# EAGLE schematic extruderControllerv1 (EAGLE 9.3.1)
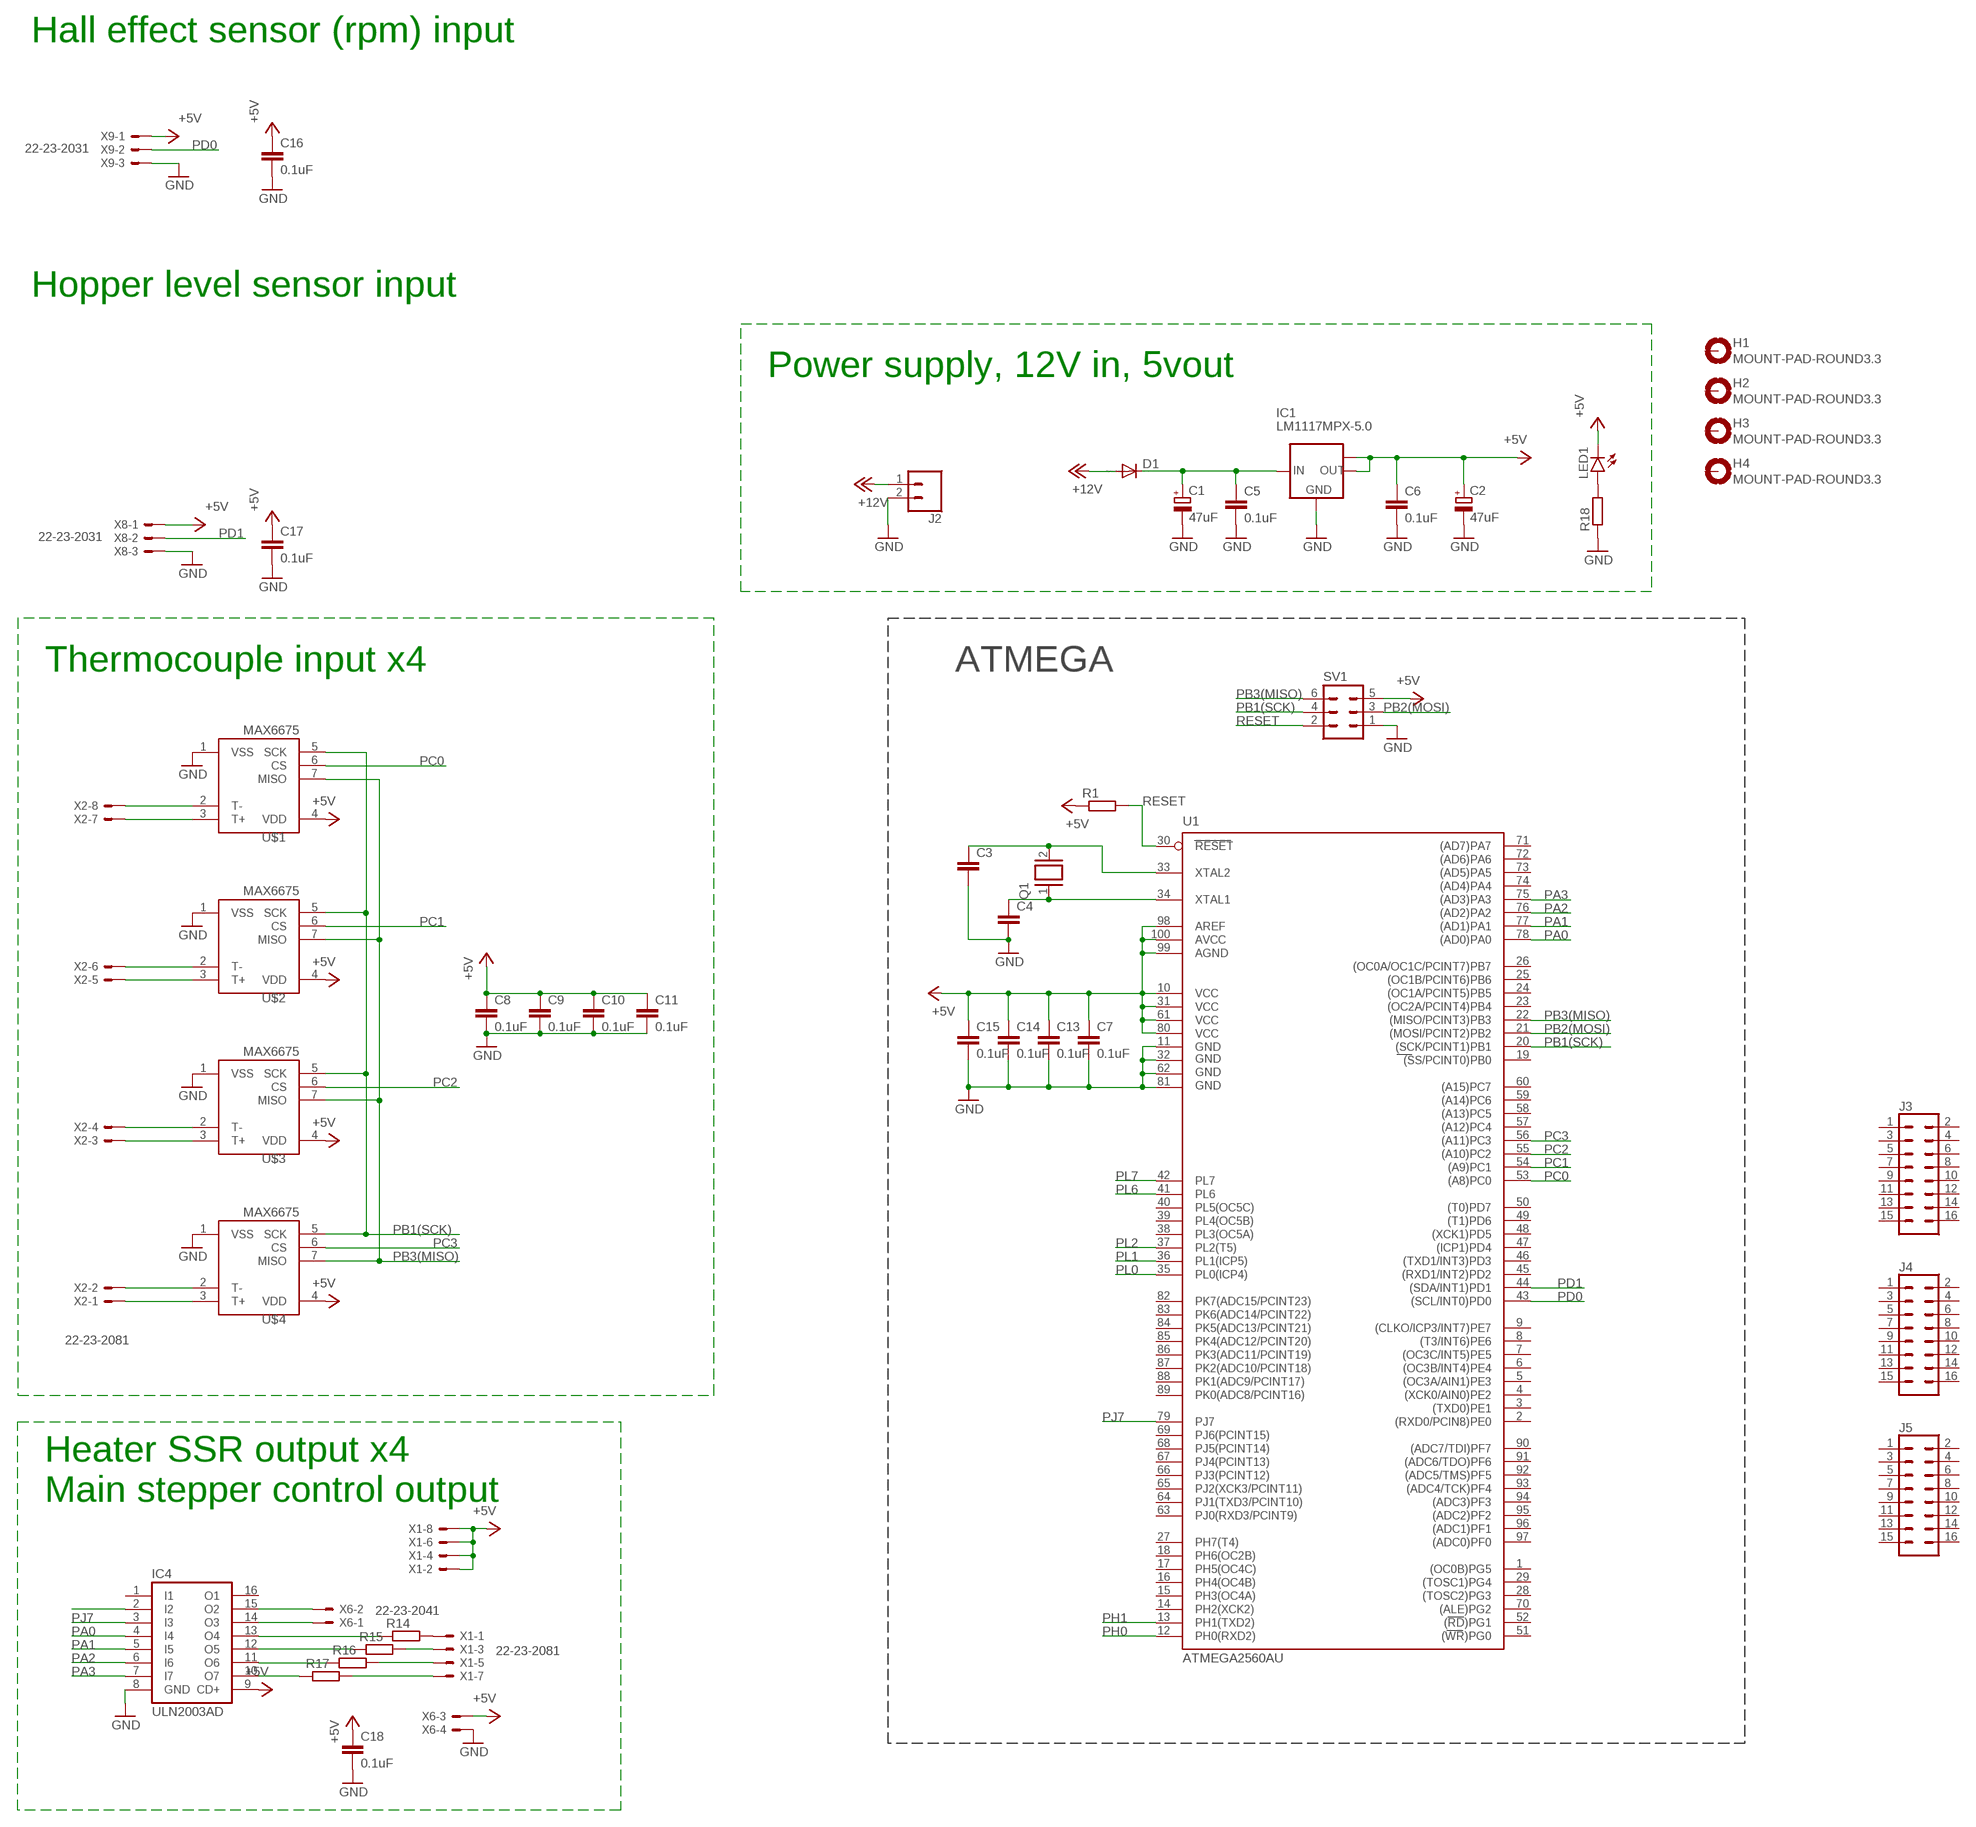
[diagram p0: schematic, sheet 1, part 1 of 3]
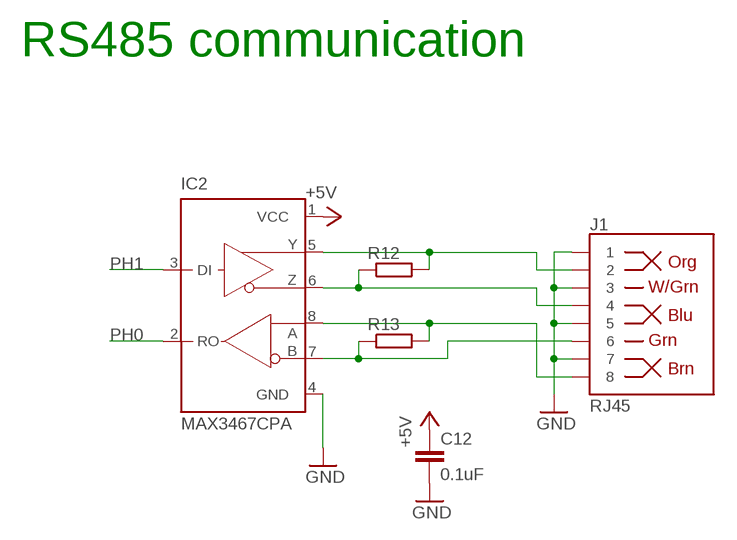
[diagram p1: schematic, sheet 1, part 2 of 3]
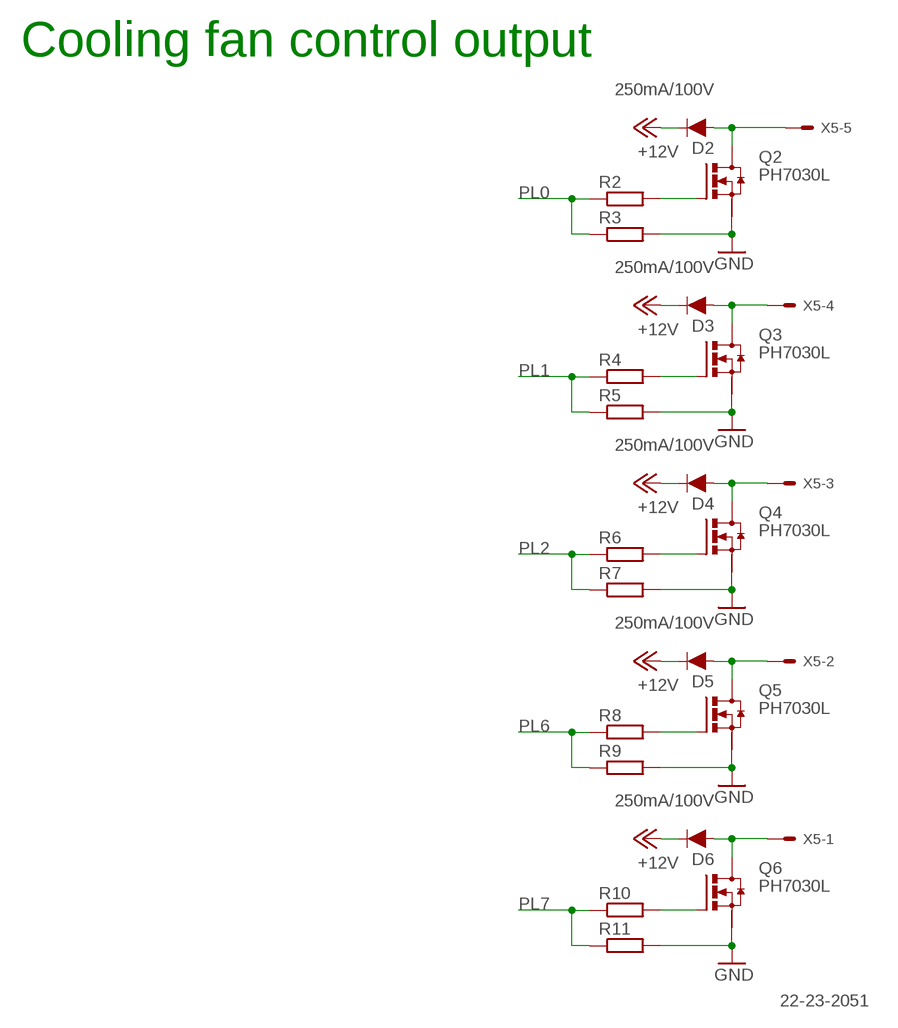
[diagram p2: schematic, sheet 1, part 3 of 3]

## Parts
C1  47uF  CPOL-EUD  [PANASONIC_D]
C2  47uF  CPOL-EUD  [PANASONIC_D]
C3  C-EUC0603  [C0603]
C4  C-EUC0603  [C0603]
C5  0.1uF  C-EUC0603  [C0603]
C6  0.1uF  C-EUC0603  [C0603]
C7  0.1uF  C-EUC0603  [C0603]
C8  0.1uF  C-EUC0603  [C0603]
C9  0.1uF  C-EUC0603  [C0603]
C10  0.1uF  C-EUC0603  [C0603]
C11  0.1uF  C-EUC0603  [C0603]
C12  0.1uF  C-EUC0603  [C0603]
C13  0.1uF  C-EUC0603  [C0603]
C14  0.1uF  C-EUC0603  [C0603]
C15  0.1uF  C-EUC0603  [C0603]
C16  0.1uF  C-EUC0603  [C0603]
C17  0.1uF  C-EUC0603  [C0603]
C18  0.1uF  C-EUC0603  [C0603]
D1  DIODE-SMB  [SMB]
D2  250mA/100V  DIODE-BAS16J  [SOD-323]
D3  250mA/100V  DIODE-BAS16J  [SOD-323]
D4  250mA/100V  DIODE-BAS16J  [SOD-323]
D5  250mA/100V  DIODE-BAS16J  [SOD-323]
D6  250mA/100V  DIODE-BAS16J  [SOD-323]
H1  MOUNT-PAD-ROUND3.3  [3,3-PAD]
H2  MOUNT-PAD-ROUND3.3  [3,3-PAD]
H3  MOUNT-PAD-ROUND3.3  [3,3-PAD]
H4  MOUNT-PAD-ROUND3.3  [3,3-PAD]
IC1  LM1117MPX-5.0  [SOT223]
IC2  MAX3467CPA  [SO08]
IC4  ULN2003AD  [SO16]
J1  RJ45  RJ45-8  [RJ45-8]
J2  CONN_023.5MM  [SCREWTERMINAL-3.5MM-2]
J3  CONN_08X2  [2X8]
J4  CONN_08X2  [2X8]
J5  CONN_08X2  [2X8]
LED1  LEDSML1206  [SML1206]
Q1  XTAL/S  [QS]
Q2  PH7030L  [SOT669]
Q3  PH7030L  [SOT669]
Q4  PH7030L  [SOT669]
Q5  PH7030L  [SOT669]
Q6  PH7030L  [SOT669]
R1  R-EU_R0805  [R0805]
R2  R-EU_R0805  [R0805]
R3  R-EU_R0805  [R0805]
R4  R-EU_R0805  [R0805]
R5  R-EU_R0805  [R0805]
R6  R-EU_R0805  [R0805]
R7  R-EU_R0805  [R0805]
R8  R-EU_R0805  [R0805]
R9  R-EU_R0805  [R0805]
R10  R-EU_R0805  [R0805]
R11  R-EU_R0805  [R0805]
R12  R-EU_R1210  [R1210]
R13  R-EU_R1210  [R1210]
R14  R-EU_R0805  [R0805]
R15  R-EU_R0805  [R0805]
R16  R-EU_R0805  [R0805]
R17  R-EU_R0805  [R0805]
R18  R-EU_R0805  [R0805]
SV1  MA03-2  [MA03-2]
U1  ATMEGA2560AU  [TQFP100]
U$1  MAX6675  [SO08-MAX6675]
U$2  MAX6675  [SO08-MAX6675]
U$3  MAX6675  [SO08-MAX6675]
U$4  MAX6675  [SO08-MAX6675]
X1  22-23-2081  [22-23-2081]
X2  22-23-2081  [22-23-2081]
X5  22-23-2051  [22-23-2051]
X6  22-23-2041  [22-23-2041]
X8  22-23-2031  [22-23-2031]
X9  22-23-2031  [22-23-2031]

## Nets
+5V: C2.+ C6.1 C7.1 C8.1 C9.1 C10.1 C11.1 C12.1 C13.1 C14.1 C15.1 C16.1 C17.1 C18.1 IC1.2(OUT) IC1.TAB(OUT1) IC2.1(VCC) IC4.9(CD+) LED1.C R1.1 SV1.5 U1.10(VCC) U1.31(VCC1) U1.61(VCC2) U1.80(VCC3) U1.98(AREF) U1.99(AGND) U1.100(AVCC) U$1.4(VDD) U$2.4(VDD) U$3.4(VDD) U$4.4(VDD) X1.2 X1.4 X1.6 X1.8 X6.3 X8.1 X9.1
+12V: D1.A D2.C D3.C D4.C D5.C D6.C J2.1
GND: C1.- C2.- C3.2 C4.2 C5.2 C6.2 C7.2 C8.2 C9.2 C10.2 C11.2 C12.2 C13.2 C14.2 C15.2 C16.2 C17.2 C18.2 IC1.1(GND) IC2.4(GND) IC4.8(GND) J1.1 J1.3 J1.5 J1.7 J2.2 R18.1 SV1.1 U1.11(GND) U1.32(GND1) U1.62(GND2) U1.81(GND3) U$1.1(VSS) U$2.1(VSS) U$3.1(VSS) U$4.1(VSS) X6.4 X8.3 X9.3
N$2: Q2.4(G) R2.2
N$3: R14.2 X1.1
N$4: U$1.2(T-) X2.8
N$5: U$1.3(T+) X2.7
N$6: U$2.2(T-) X2.6
N$7: U$2.3(T+) X2.5
N$8: U$3.2(T-) X2.4
N$9: U$3.3(T+) X2.3
N$10: U$4.2(T-) X2.2
N$11: U$4.3(T+) X2.1
N$12: R15.2 X1.3
N$13: R16.2 X1.5
N$14: R17.2 X1.7
N$15: Q2.1(S) Q3.1(S) Q4.1(S) Q5.1(S) Q6.1(S) R3.2 R5.2 R7.2 R9.2 R11.2 ; supply symbol labelled GND
N$18: C1.+ C5.1 D1.C IC1.3(IN)
N$19: C3.1 Q1.2 U1.33(XTAL2)
N$20: C4.1 Q1.1 U1.34(XTAL1)
N$21: IC4.14(O3) X6.1
N$22: D2.A Q2.MB(D) X5.5
N$23: Q3.4(G) R4.2
N$24: IC4.15(O2) X6.2
N$25: D3.A Q3.MB(D) X5.4
N$26: Q4.4(G) R6.2
N$27: IC2.7(B) J1.6 R13.1
N$28: D4.A Q4.MB(D) X5.3
N$29: Q5.4(G) R8.2
N$30: IC4.13(O4) R14.1
N$31: D5.A Q5.MB(D) X5.2
N$32: Q6.4(G) R10.2
N$33: IC2.6(Z) J1.4 R12.1
N$34: D6.A Q6.MB(D) X5.1
N$35: IC2.5(Y) J1.2 R12.2
N$36: IC2.8(A) J1.8 R13.2
N$37: IC4.2(I2)
N$38: IC4.12(O5) R15.1
N$39: IC4.11(O6) R16.1
N$40: IC4.10(O7) R17.1
N$41: LED1.A R18.2
PA0: IC4.4(I4) U1.78((AD0)PA0)
PA1: IC4.5(I5) U1.77((AD1)PA1)
PA2: IC4.6(I6) U1.76((AD2)PA2)
PA3: IC4.7(I7) U1.75((AD3)PA3)
PB1(SCK): SV1.4 U1.20((SCK/PCINT1)PB1) U$1.5(SCK) U$2.5(SCK) U$3.5(SCK) U$4.5(SCK)
PB2(MOSI): SV1.3 U1.21((MOSI/PCINT2)PB2)
PB3(MISO): SV1.6 U1.22((MISO/PCINT3)PB3) U$1.7(MISO) U$2.7(MISO) U$3.7(MISO) U$4.7(MISO)
PC0: U1.53((A8)PC0) U$1.6(CS)
PC1: U1.54((A9)PC1) U$2.6(CS)
PC2: U1.55((A10)PC2) U$3.6(CS)
PC3: U1.56((A11)PC3) U$4.6(CS)
PD0: U1.43((SCL/INT0)PD0) X9.2
PD1: U1.44((SDA/INT1)PD1) X8.2
PH0: IC2.2(RO) U1.12(PH0(RXD2))
PH1: IC2.3(DI) U1.13(PH1(TXD2))
PJ7: IC4.3(I3) U1.79(PJ7)
PL0: R2.1 R3.1 U1.35(PL0(ICP4))
PL1: R4.1 R5.1 U1.36(PL1(ICP5))
PL2: R6.1 R7.1 U1.37(PL2(T5))
PL6: R8.1 R9.1 U1.41(PL6)
PL7: R10.1 R11.1 U1.42(PL7)
RESET: R1.2 SV1.2 U1.30(RESET)
Unconnected: H1.B3,3(MOUNT) H2.B3,3(MOUNT) H3.B3,3(MOUNT) H4.B3,3(MOUNT) IC4.1(I1) IC4.16(O1) J3.1 J3.2 J3.3 J3.4 J3.5 J3.6 J3.7 J3.8 J3.9 J3.10 J3.11 J3.12 J3.13 J3.14 J3.15 J3.16 J4.1 J4.2 J4.3 J4.4 J4.5 J4.6 J4.7 J4.8 J4.9 J4.10 J4.11 J4.12 J4.13 J4.14 J4.15 J4.16 J5.1 J5.2 J5.3 J5.4 J5.5 J5.6 J5.7 J5.8 J5.9 J5.10 J5.11 J5.12 J5.13 J5.14 J5.15 J5.16 Q2.2(S) Q2.3(S) Q3.2(S) Q3.3(S) Q4.2(S) Q4.3(S) Q5.2(S) Q5.3(S) Q6.2(S) Q6.3(S) U1.1((OC0B)PG5) U1.2((RXD0/PCIN8)PE0) U1.3((TXD0)PE1) U1.4((XCK0/AIN0)PE2) U1.5((OC3A/AIN1)PE3) U1.6((OC3B/INT4)PE4) U1.7((OC3C/INT5)PE5) U1.8((T3/INT6)PE6) U1.9((CLKO/ICP3/INT7)PE7) U1.14(PH2(XCK2)) U1.15(PH3(OC4A)) U1.16(PH4(OC4B)) U1.17(PH5(OC4C)) U1.18(PH6(OC2B)) U1.19((SS/PCINT0)PB0) U1.23((OC2A/PCINT4)PB4) U1.24((OC1A/PCINT5)PB5) U1.25((OC1B/PCINT6)PB6) U1.26((OC0A/OC1C/PCINT7)PB7) U1.27(PH7(T4)) U1.28((TOSC2)PG3) U1.29((TOSC1)PG4) U1.38(PL3(OC5A)) U1.39(PL4(OC5B)) U1.40(PL5(OC5C)) U1.45((RXD1/INT2)PD2) U1.46((TXD1/INT3)PD3) U1.47((ICP1)PD4) U1.48((XCK1)PD5) U1.49((T1)PD6) U1.50((T0)PD7) U1.51((WR)PG0) U1.52((RD)PG1) U1.57((A12)PC4) U1.58((A13)PC5) U1.59((A14)PC6) U1.60((A15)PC7) U1.63(PJ0(RXD3/PCINT9)) U1.64(PJ1(TXD3/PCINT10)) U1.65(PJ2(XCK3/PCINT11)) U1.66(PJ3(PCINT12)) U1.67(PJ4(PCINT13)) U1.68(PJ5(PCINT14)) U1.69(PJ6(PCINT15)) U1.70((ALE)PG2) U1.71((AD7)PA7) U1.72((AD6)PA6) U1.73((AD5)PA5) U1.74((AD4)PA4) U1.82(PK7(ADC15/PCINT23)) U1.83(PK6(ADC14/PCINT22)) U1.84(PK5(ADC13/PCINT21)) U1.85(PK4(ADC12/PCINT20)) U1.86(PK3(ADC11/PCINT19)) U1.87(PK2(ADC10/PCINT18)) U1.88(PK1(ADC9/PCINT17)) U1.89(PK0(ADC8/PCINT16)) U1.90((ADC7/TDI)PF7) U1.91((ADC6/TDO)PF6) U1.92((ADC5/TMS)PF5) U1.93((ADC4/TCK)PF4) U1.94((ADC3)PF3) U1.95((ADC2)PF2) U1.96((ADC1)PF1) U1.97((ADC0)PF0)

## Notes on the sheet
- Hall effect sensor (rpm) input
- Hopper level sensor input
- Power supply, 12V in, 5vout
- RS485 communication
- Thermocouple input x4 | ATMEGA
- Heater SSR output x4
- Main stepper control output
- Cooling fan control output

## Library data of the parts
C1 C2 = rcl:CPOL-EU: POLARIZED CAPACITOR, European symbol; SPICEPREFIX: C
C3-C18 = rcl:C-EU: CAPACITOR, European symbol; SPICEPREFIX: C
D1 = diode:DIODE-: DIODE
D2-D6 = SparkFun-DiscreteSemi:DIODE: Diode These are standard reverse protection diodes and small signal diodes. SparkFun Products: SparkFun SparkPunk Sound Kit <https://www.sparkfun.com/products/11177> SparkFun ESP8266 Thing <https://www.sparkfun.com/products/13231>; PROD_ID: DIO-09646
H1-H4 = holes:MOUNT-PAD-ROUND: MOUNTING PAD, round
IC1 = lm1117:LM1117MPX-*
IC2 = maxim:MAX3467*: +5V, Fail-Safe, 40Mbps, Profibus RS-485/RS-422 Transceivers Source: MAX3465-MAX3469.pdf; OC_FARNELL: unknown; OC_NEWARK: unknown
IC4 = uln-udn:ULN2003A: DRIVER ARRAY
J1 = SparkFun-Connectors:RJ45-8: RJ45 Jack - 8 pin Simple RJ45, 8-pin connection. Commonly used for Cat5, Cat5e, and Cat6 Ethernet cables. Here is the connector we sell at SparkFun: RJ45 8-Pin Connector <https://www.sparkfun.com/products/643> (PRT-00643) Datasheet <https://cdn.sparkfun.com/datasheets/Prototyping/04908.pdf> It is used on this SparkFun product: SparkFun RJ45 Breakout <https://www.sparkfun.com/products/716> (BOB-00716) Note, you may also be interested in the "MAGJACK" version of this. It is basically a RJ45 connector, but also has some status LEDs built into the connector housing. You can check that out in this library at the device named "MAGJACK.dev" and see these products online: RJ45 Ethernet MagJack-Compatible <https://www.sparkfun.com/products/8534> (PRT-08534) SparkFun RJ45 MagJack Breakout <https://www.sparkfun.com/products/13021> (BOB-13021); PROD_ID: CONN-08506; SF_ID: PRT-00643
J2 = SparkFun-Connectors:CONN_02: Multi connection point. Often used as Generic Header-pin footprint for 0.1 inch spaced/style header connections On any of the 0.1 inch spaced packages, you can populate with these: Break Away Headers - Straight <https://www.sparkfun.com/products/116> (PRT-00116) Break Away Male Headers - Right Angle <https://www.sparkfun.com/products/553> (PRT-00553) Female Headers <https://www.sparkfun.com/products/115> (PRT-00115) Break Away Headers - Machine Pin <https://www.sparkfun.com/products/117> (PRT-00117) Break Away Female Headers - Swiss Machine Pin <https://www.sparkfun.com/products/743> (PRT-00743) For SCREWTERMINALS and SPRING TERMINALS visit here: Screw Terimnals on SparkFun.com <https://www.sparkfun.com/search/results?term=Screw+Terminals> (5mm/3.5mm/2.54mm spacing) This device is also useful as a general connection point to wire up your design to another part of your project. Our various solder wires solder well into these plated through hole pads. Hook-Up Wire - Assortment (Stranded, 22 AWG) <https://www.sparkfun.com/products/11375> (PRT-11375) Hook-Up Wire - Assortment (Solid Core, 22 AWG) <https://www.sparkfun.com/products/11367> (PRT-11367) View the entire wire category on our website here <https://www.sparkfun.com/categories/141> Special notes: Molex polarized connector foot print use with: PRT-08233 with associated crimp pins and housings. 2.54_SCREWTERM for use with PRT-10571. 3.5mm Screw Terminal footprints for PRT-08084 5mm Screw Terminal footprints for use with PRT-08432; PROD_ID: CONN-08399
J3-J5 = SparkFun-Connectors:CONN_08X2: Multi connection point. Often used as Generic Header-pin footprint for 0.1 inch spaced/style header connections You can populate with any combo of single row headers, but if you'd like an exact match, check this: Header - 2x8 (Male, 0.1") <https://www.sparkfun.com/products/13156> (PRT-13156) On any of the 0.1 inch spaced packages, you can populate with these: Break Away Headers - Straight <https://www.sparkfun.com/products/116> (PRT-00116) Break Away Male Headers - Right Angle <https://www.sparkfun.com/products/553> (PRT-00553) Female Headers <https://www.sparkfun.com/products/115> (PRT-00115) Break Away Headers - Machine Pin <https://www.sparkfun.com/products/117> (PRT-00117) Break Away Female Headers - Swiss Machine Pin <https://www.sparkfun.com/products/743> (PRT-00743)
LED1 = led:LED: LED OSRAM: - CHIPLED LG R971, LG N971, LY N971, LG Q971, LY Q971, LO R971, LY R971 LH N974, LH R974 LS Q976, LO Q976, LY Q976 LO Q996 - Hyper CHIPLED LW Q18S LB Q993, LB Q99A, LB R99A - SideLED LS A670, LO A670, LY A670, LG A670, LP A670 LB A673, LV A673, LT A673, LW A673 LH A674 LY A675 LS A676, LA A676, LO A676, LY A676, LW A676 LS A679, LY A679, LG A679 - Hyper Micro SIDELED® LS Y876, LA Y876, LO Y876, LY Y876 LT Y87S - SmartLED LW L88C, LW L88S LB L89C, LB L89S, LG L890 LS L89K, LO L89K, LY L89K LS L896, LA L896, LO L896, LY L896 - TOPLED LS T670, LO T670, LY T670, LG T670, LP T670 LSG T670, LSP T670, LSY T670, LOP T670, LYG T670 LG T671, LOG T671, LSG T671 LB T673, LV T673, LT T673, LW T673 LH T674 LS T676, LA T676, LO T676, LY T676, LB T676, LH T676, LSB T676, LW T676 LB T67C, LV T67C, LT T67C, LS T67K, LO T67K, LY T67K, LW E67C LS E67B, LA E67B, LO E67B, LY E67B, LB E67C, LV E67C, LT E67C LW T67C LS T679, LY T679, LG T679 LS T770, LO T770, LY T770, LG T770, LP T770 LB T773, LV T773, LT T773, LW T773 LH T774 LS E675, LA E675, LY E675, LS T675 LS T776, LA T776, LO T776, LY T776, LB T776 LHGB T686 LT T68C, LB T68C - Hyper Mini TOPLED® LB M676 - Mini TOPLED Santana® LG M470 LS M47K, LO M47K, LY M47K Source: http://www.osram.convergy.de LUXEON: - LUMILED® LXK2-PW12-R00, LXK2-PW12-S00, LXK2-PW14-U00, LXK2-PW14-V00 LXK2-PM12-R00, LXK2-PM12-S00, LXK2-PM14-U00 LXK2-PE12-Q00, LXK2-PE12-R00, LXK2-PE12-S00, LXK2-PE14-T00, LXK2-PE14-U00 LXK2-PB12-K00, LXK2-PB12-L00, LXK2-PB12-M00, LXK2-PB14-N00, LXK2-PB14-P00, LXK2-PB14-Q00 LXK2-PR12-L00, LXK2-PR12-M00, LXK2-PR14-Q00, LXK2-PR14-R00 LXK2-PD12-Q00, LXK2-PD12-R00, LXK2-PD12-S00 LXK2-PH12-R00, LXK2-PH12-S00 LXK2-PL12-P00, LXK2-PL12-Q00, LXK2-PL12-R00 Source: www.luxeon.com KINGBRIGHT: KA-3528ASYC Source: www.kingbright.com
Q1 = special:XTAL/S: CRYSTAL
Q2-Q6 = transistor-power:PH7030L: N-channel TrenchMOS (TM) logic level FET Source: http://www.nxp.com/acrobat_download/datasheets/PH7030L_4.pdf
R1-R18 = rcl:R-EU_: RESISTOR, European symbol; SPICEPREFIX: R
SV1 = con-lstb:MA03-2: PIN HEADER; OC_FARNELL: unknown; OC_NEWARK: unknown
U1 = SparkFun-IC-Microcontroller:ATMEGA2560: Atmel 100-pin 8-bit uC 64/128/256 Kbytes FLASH 4 Kbytes EEPROM 8 Kbytes SRAM 86 General Purpose I/O pins 12-channels16-bit PWM 4 x Serial USARTs 16-channels 10-bit A/D SparkFun Products None.; PROD_ID: IC-10040
U$1-U$4 = SparkFun-AnalogIC:MAX6675: K-type thermocouple ADC, SPI output
X1 X2 = con-molex:22-23-2081: .100" (2.54mm) Center Header - 8 Pin; MF: MOLEX; MPN: 22-23-2081; OC_FARNELL: 1756826; OC_NEWARK: 01C7592
X5 = con-molex:22-23-2051: .100" (2.54mm) Center Header - 5 Pin; MF: MOLEX; MPN: 22-23-2051; OC_FARNELL: 1462952; OC_NEWARK: 38C9178
X6 = con-molex:22-23-2041: .100" (2.54mm) Center Header - 4 Pin; MF: MOLEX; MPN: 22-23-2041; OC_FARNELL: 1462920; OC_NEWARK: 38C0355
X8 X9 = con-molex:22-23-2031: .100" (2.54mm) Center Header - 3 Pin; MF: MOLEX; MPN: 22-23-2031; OC_FARNELL: 1462950; OC_NEWARK: 30C0862